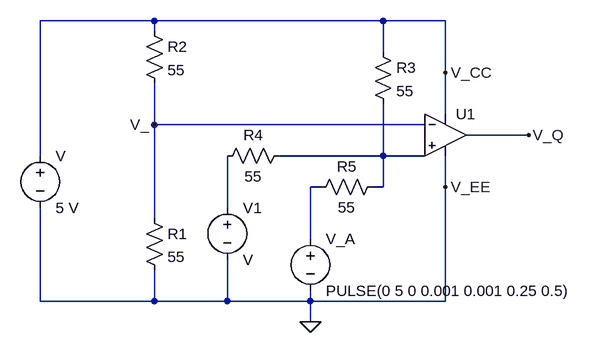
[diagram p0: schematic assig2_q3.asc]
assig2_q3.asc, the LTspice schematic file:
Version 4
SHEET 1 880 680
WIRE -176 -128 -352 -128
WIRE 176 -128 -176 -128
WIRE 272 -128 176 -128
WIRE -176 -112 -176 -128
WIRE 176 -80 176 -128
WIRE 272 -48 272 -128
WIRE 272 16 272 -48
WIRE -176 32 -176 -32
WIRE 240 32 -176 32
WIRE 400 48 304 48
WIRE -352 80 -352 -128
WIRE 176 80 176 0
WIRE 176 80 16 80
WIRE 240 80 240 64
WIRE 240 80 176 80
WIRE 80 128 64 128
WIRE 176 128 176 80
WIRE 176 128 160 128
WIRE 272 128 272 80
WIRE -64 160 -64 80
WIRE -176 176 -176 32
WIRE 64 208 64 128
WIRE -352 304 -352 160
WIRE -176 304 -176 256
WIRE -176 304 -352 304
WIRE -64 304 -64 240
WIRE -64 304 -176 304
WIRE 64 304 64 288
WIRE 64 304 -64 304
WIRE 272 304 272 128
WIRE 272 304 64 304
WIRE 64 336 64 304
FLAG 64 336 0
FLAG 272 128 V_EE
FLAG 272 -48 V_CC
FLAG 400 48 V_Q
FLAG -176 32 V_
SYMBOL res -192 160 R0
SYMATTR InstName R1
SYMATTR Value 55
SYMBOL res -192 -128 R0
SYMATTR InstName R2
SYMATTR Value 55
SYMBOL voltage -352 64 R0
SYMATTR InstName V
SYMATTR Value 5 V
SYMBOL OpAmps\\UniversalOpamp2 272 48 R0
SYMATTR InstName U1
SYMBOL voltage 64 192 R0
WINDOW 123 0 0 Left 0
WINDOW 39 0 0 Left 0
SYMATTR InstName V_A
SYMATTR Value PULSE(0 5 0 0.001 0.001 0.25 0.5)
SYMBOL res 160 -96 R0
SYMATTR InstName R3
SYMATTR Value 55
SYMBOL res 32 64 R90
WINDOW 0 0 56 VBottom 2
WINDOW 3 32 56 VTop 2
SYMATTR InstName R4
SYMATTR Value 55
SYMBOL res 176 112 R90
WINDOW 0 0 56 VBottom 2
WINDOW 3 32 56 VTop 2
SYMATTR InstName R5
SYMATTR Value 55
SYMBOL voltage -64 144 R0
SYMATTR InstName V1

The netlist it stands for:
* assig2_q3.asc
R1 V_ 0 55
R2 V_CC V_ 55
V V_CC 0 5 V
XU1 N001 V_ V_CC 0 V_Q level.2 Avol=1Meg GBW=10Meg Slew=10Meg ilimit=25m rail=0 Vos=0 phimargin=45 en=0 enk=0 in=0 ink=0 Rin=500Meg  ; pins IN+ IN- V+ V- OUT
V_A N002 0 PULSE(0 5 0 0.001 0.001 0.25 0.5)
R3 V_CC N001 55
R4 N001 N003 55
R5 N001 N002 55
V1 N003 0 V
.lib UniversalOpamps2.sub
.backanno
.end